# EAGLE design mazel293d (EAGLE 9.6.2)
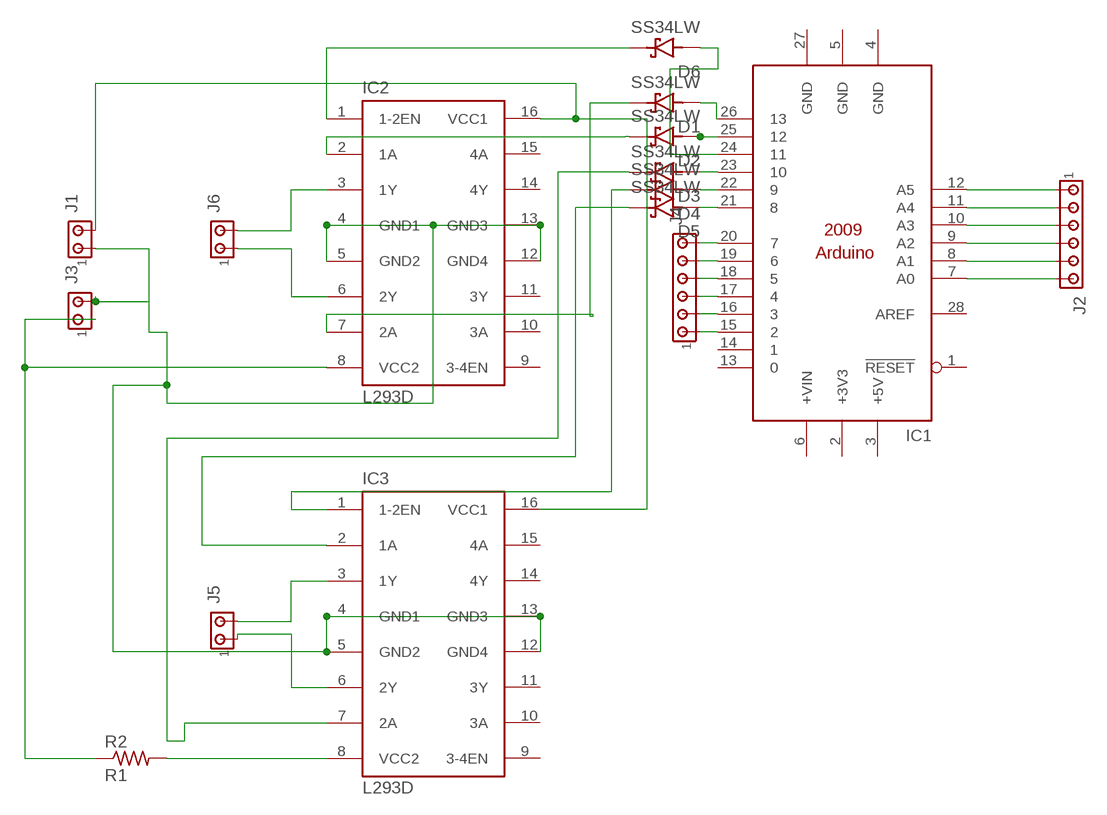
[diagram p0: schematic, sheet 1]

## Parts
D1  SS34LW  [SODFL3718X102N]
D2  SS34LW  [SODFL3718X102N]
D3  SS34LW  [SODFL3718X102N]
D4  SS34LW  [SODFL3718X102N]
D5  SS34LW  [SODFL3718X102N]
D6  SS34LW  [SODFL3718X102N]
IC1  ARDUINO2009_10  [ARDUINO2009]
IC2  L293D  [DIL16]
IC3  L293D  [DIL16]
J1  MTA02-100  [10X02MTA]
J2  Line Tracer Relimate  MTA06-100  [10X06MTA]
J3  MTA02-100  [10X02MTA]
J4  Line Tracer Relimate  MTA06-100  [10X06MTA]
J5  MTA02-100  [10X02MTA]
J6  MTA02-100  [10X02MTA]
R2  R1  R-US_0204/7  [0204/7]

## Nets
N$1: IC3.8(VCC2) R2.2
N$2: IC1.12(A5) J2.6
N$3: IC3.3(1Y) J5.2
N$4: IC3.6(2Y) J5.1
N$5: D1.A IC1.26
N$6: IC2.3(1Y) J6.2
N$7: IC1.20 J4.1
N$8: IC1.19 J4.2
N$9: IC2.6(2Y) J6.1
N$10: D6.C(K) IC2.1(1-2EN)
N$11: IC1.18 J4.3
N$12: IC2.4(GND1) IC2.5(GND2) IC2.12(GND4) IC2.13(GND3) IC3.4(GND1) IC3.5(GND2) IC3.12(GND4) IC3.13(GND3) J1.1 J3.2
N$13: D2.C(K) IC2.2(1A)
N$14: D2.A IC1.25
N$15: IC1.17 J4.4
N$16: IC1.16 J4.5
N$17: IC1.15 J4.6
N$18: IC1.11(A4) J2.5
N$19: IC1.10(A3) J2.4
N$20: IC1.9(A2) J2.3
N$21: IC1.8(A1) J2.2
N$22: IC1.7(A0) J2.1
N$23: D1.C(K) IC2.7(2A)
N$24: D3.C(K) IC3.7(2A)
N$25: D5.C(K) IC3.2(1A)
N$26: D4.C(K) IC3.1(1-2EN)
N$27: D3.A IC1.23
N$28: D4.A IC1.22
N$29: D5.A IC1.21
N$30: IC2.16(VCC1) IC3.16(VCC1) J1.2
N$31: D6.A IC1.24
N$32: IC2.8(VCC2) J3.1 R2.1
Unconnected: IC1.1(!RESET) IC1.6(+VIN) IC1.13 IC1.14 IC1.28(AREF) IC2.9(3-4EN) IC2.10(3A) IC2.11(3Y) IC2.14(4Y) IC2.15(4A) IC3.9(3-4EN) IC3.10(3A) IC3.11(3Y) IC3.14(4Y) IC3.15(4A)

## Power pins joined to a net without a drawn wire
+3V3: IC1.2(+3V3)
+5V: IC1.3(+5V)
GND: IC1.4(GND) IC1.5(GND) IC1.27(GND)

## Library data of the parts
D1-D6 = SS34LW:SS34LW: Check availability <https://pricing.snapeda.com/parts/SS34LW/Taiwan%20Semiconductor/view-part?ref=eda>; AVAILABILITY: In Stock; CHECK_PRICES: https://www.snapeda.com/parts/SS34LW/Taiwan+Semiconductor/view-part/?ref=eda; DESCRIPTION: 3A, 40V, Schottky Rectifier; MF: Taiwan Semiconductor; MP: SS34LW; PACKAGE: SOD-123W-2 Taiwan Semiconductor; PRICE: None; PURCHASE-URL: https://www.snapeda.com/api/url_track_click_mouser/?unipart_id=4812745&manufacturer=Taiwan Semiconductor&part_name=SS34LW&search_term=ss34; SNAPEDA_LINK: https://www.snapeda.com/parts/SS34LW/Taiwan+Semiconductor/view-part/?ref=snap
IC1 = arduino:ARDUINO2009_1: The Arduino Duemilanove ("2009") is a microcontroller board based on the ATmega168 or ATmega328. - 14 digital input/output pins (of which 6 can be used as PWM outputs) - 6 analog inputs, a 16 MHz crystal oscillator - USB connection - power jack - ISP header - reset button It contains everything needed to support the microcontroller; simply connect it to a computer with a USB cable or power it with a AC-to-DC adapter or battery to get started http://arduino.cc/en/Main/ArduinoBoardDuemilanove
IC2 IC3 = st-microelectronics:L293D: PUSH-PULL 4 CHANNEL DRIVER; MPN: L293D; OC_FARNELL: 9589619; OC_NEWARK: 56P8249
J1 J3 J5 J6 = con-amp:MTA02-100: AMP connector
J2 J4 = con-amp:MTA06-100: AMP connector
R2 = adafruit:R-US_: RESISTOR, American symbol

## Board
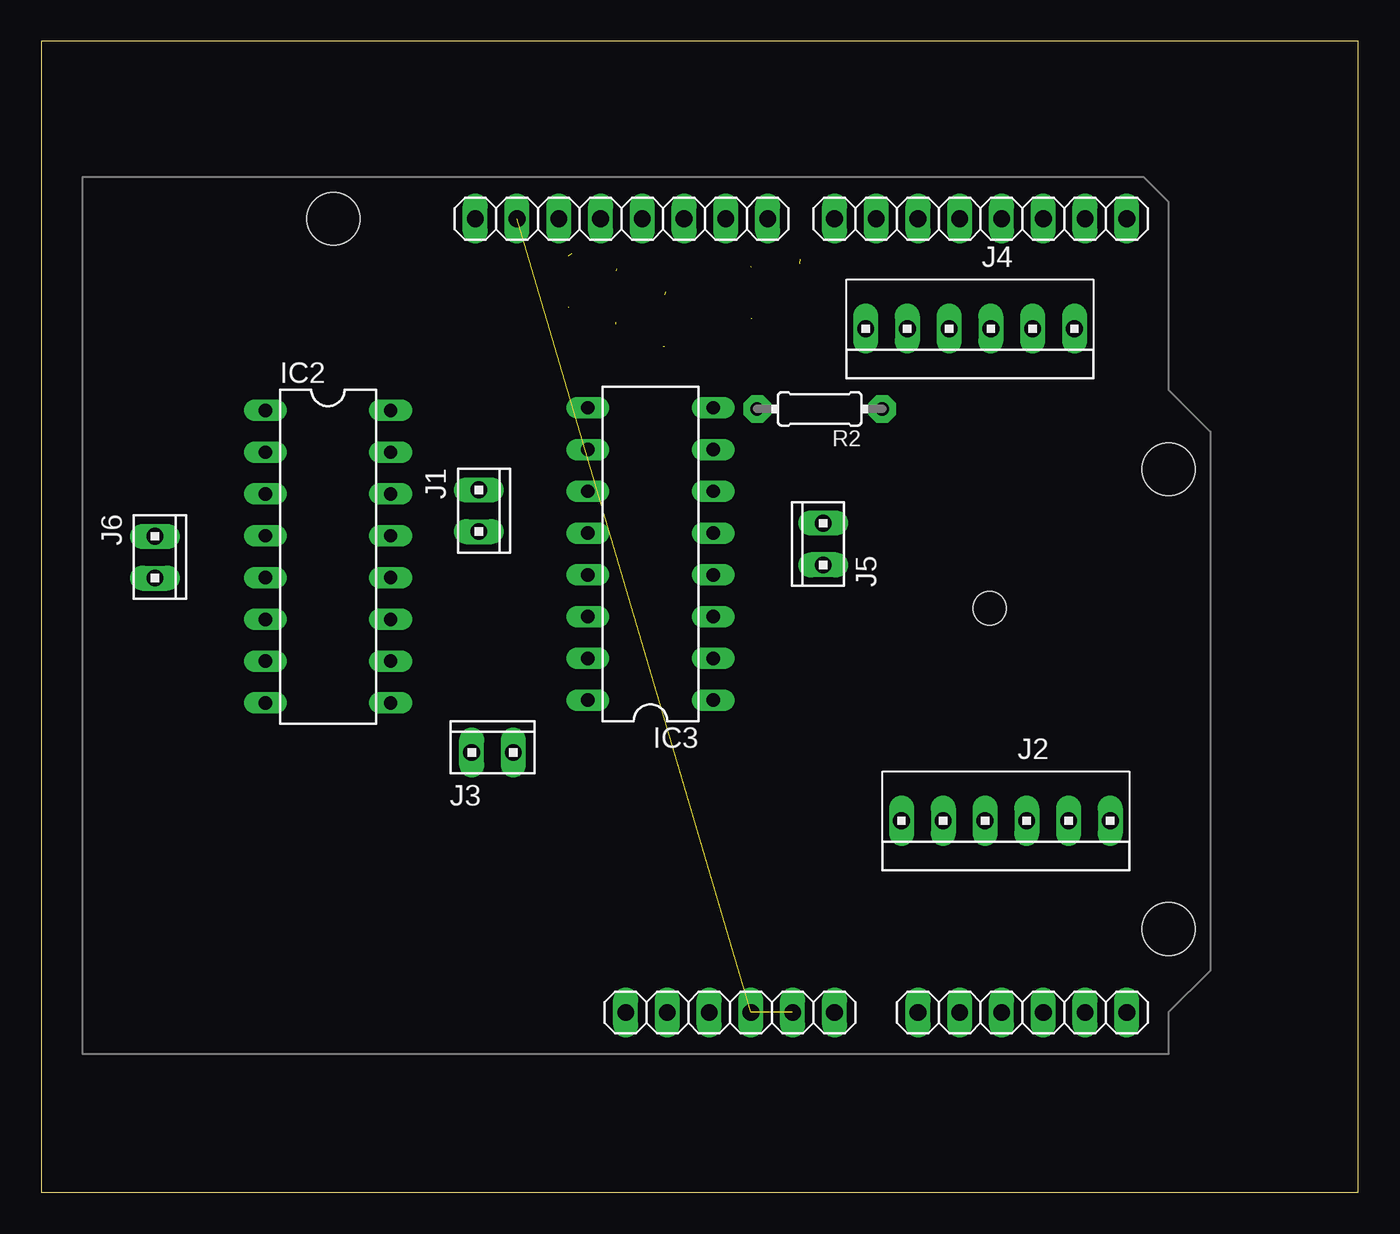
[diagram p1: board, top side]
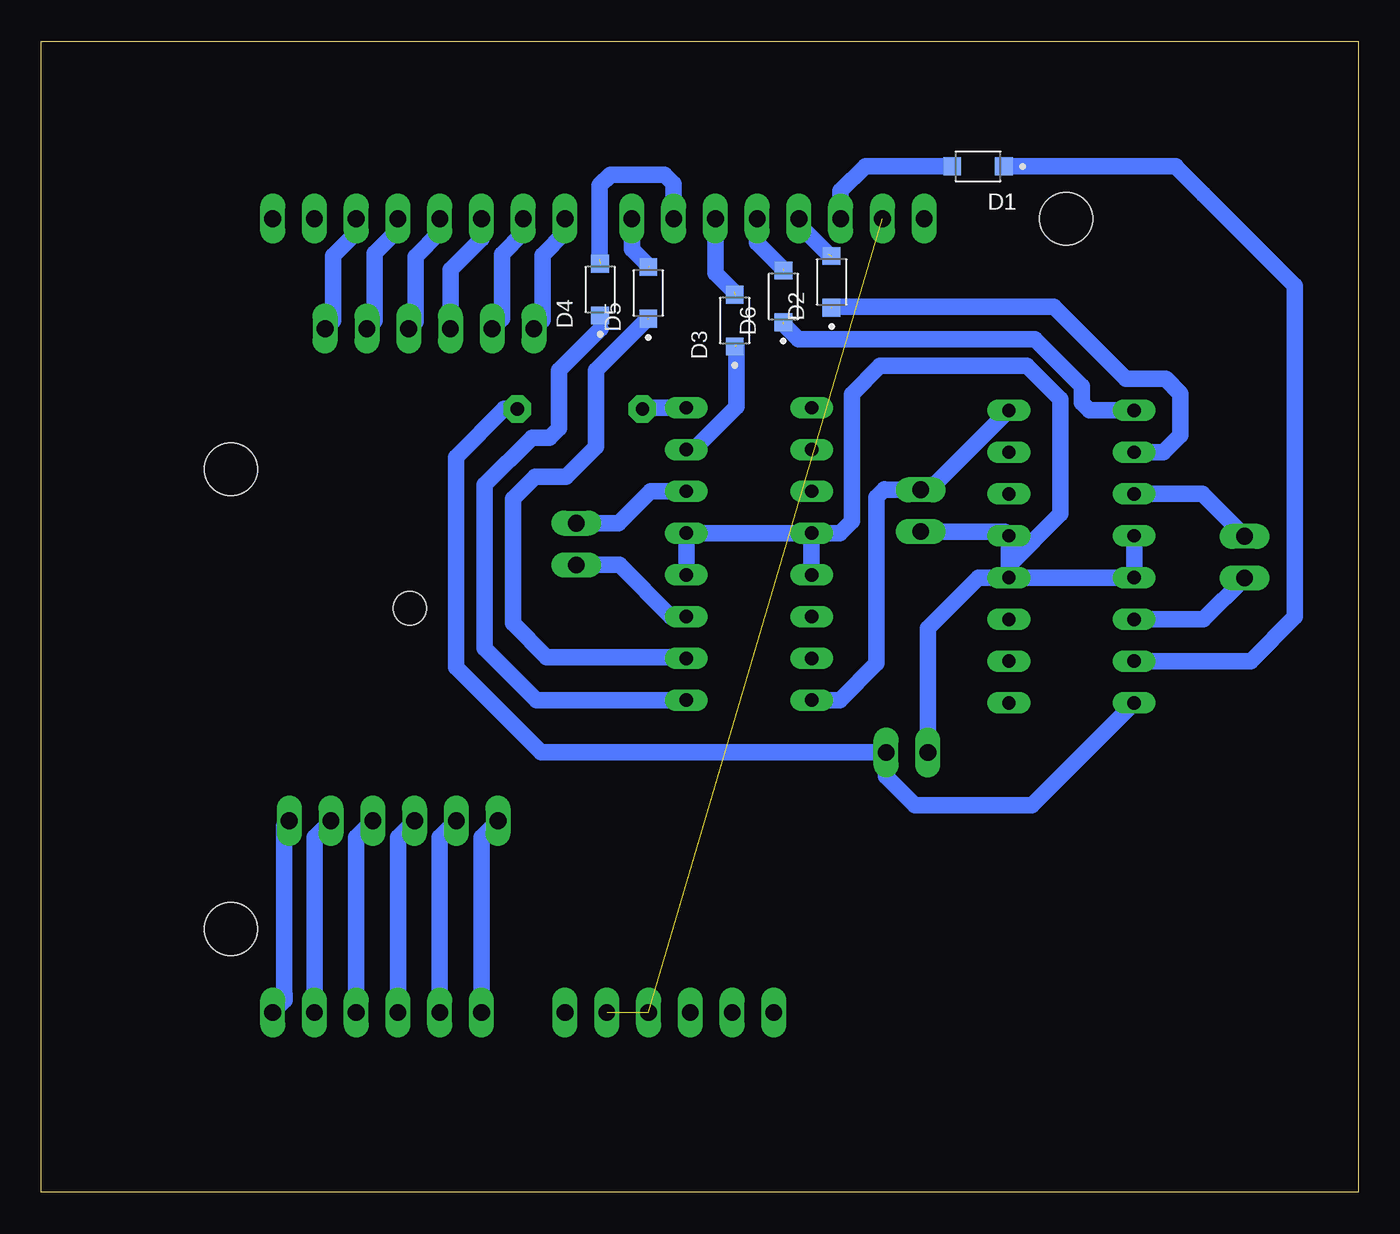
[diagram p2: board, bottom side, seen from below]

Size 80.12 x 70 mm. Coordinates in mm from the lower left corner, seen from the top.
Outline: 0,0 80.12,0 80.12,70 0,70 0,0
Copper layers (1*16): Top 0.035mm / dielectric 1.5mm / Bottom 0.035mm
Design rules "default": minimum track width 6mil, minimum drill 0.35mm, track to track 6mil, track to pad 6mil, pad to pad 6mil, via to via 6mil, smd to smd 6mil, copper to edge 40mil, drill to drill 6mil, minimum pad ring 10mil, minimum via ring 8mil, stop-mask expansion 4mil, vias tented up to drill 0mil, thermal gap 10mil

### Footprints (pad centres in the part's own frame; a part is rotated, then mirrored left to right if it is on the bottom)
SODFL3718X102N = smd 1.08 x 1.09: A 1.575,0; C -1.575,0
ARDUINO2009 = drill 1.016 long: 1 33.02,2.54; 2 35.56,2.54; 3 38.1,2.54; 4 40.64,2.54; 5 43.18,2.54; 6 45.72,2.54; 7 50.8,2.54; 8 53.34,2.54; 9 55.88,2.54; 10 58.42,2.54; 11 60.96,2.54; 12 63.5,2.54; 13 63.5,50.8; 14 60.96,50.8; 15 58.42,50.8; 16 55.88,50.8; 17 53.34,50.8; 18 50.8,50.8; 19 48.26,50.8; 20 45.72,50.8; 21 41.656,50.8; 22 39.116,50.8; 23 36.576,50.8; 24 34.036,50.8; 25 31.496,50.8; 26 28.956,50.8; 27 26.416,50.8; 28 23.876,50.8 | hole 3.2: 15.24,50.8; 66.04,35.56; 66.04,7.62 | hole 2: 55.17,27.114
DIL16 = drill 0.813 long: 1 -8.89,-3.81; 2 -6.35,-3.81; 3 -3.81,-3.81; 4 -1.27,-3.81; 5 1.27,-3.81; 6 3.81,-3.81; 7 6.35,-3.81; 8 8.89,-3.81; 9 8.89,3.81; 10 6.35,3.81; 11 3.81,3.81; 12 1.27,3.81; 13 -1.27,3.81; 14 -3.81,3.81; 15 -6.35,3.81; 16 -8.89,3.81
10X02MTA = drill 1.016 long: 1 1.27,0; 2 -1.27,0
10X06MTA = drill 1.016 long: 1 6.35,0; 2 3.81,0; 3 1.27,0; 4 -1.27,0; 5 -3.81,0; 6 -6.35,0
0204/7 = drill 0.813 pad 1.676 octagon: 1 -3.81,0; 2 3.81,0

### Placement (x,y rotation side)
D1  23.13,62.38 180 bottom
D2  32.04,55.36 90 bottom
D3  37.93,53.01 90 bottom
D4  46.12,54.9 90 bottom
D5  43.19,54.69 90 bottom
D6  34.97,54.48 90 bottom
IC1  2.53,8.41 0 top
IC2  17.45,38.66 270 top
IC3  37.06,38.82 90 top
J1  26.62,41.45 270 top
J2  58.67,22.6 180 top
J3  27.46,26.75 0 top
J4  56.49,52.52 180 top
J5  47.57,39.42 90 top
J6  6.91,38.63 270 top
R2  47.35,47.64 180 top

### Tracks (layer width: path | path; a pad name or v marks a point on that pad's centre or on a via)
GND  (2 unrouted)
N$1
  Bottom 1.016: IC3.8 43.47,47.71 R2.2
N$2
  Bottom 1.016: J2.6 65.32,22.31 65.32,12.03 65.3,12.05 65.3,11.68 IC1.12
N$3
  Bottom 1.016: IC3.3 41.81,35.01 44.95,38.15 J5.2
N$4
  Bottom 1.016: IC3.6 43.06,42.63 45,40.69 J5.1
N$5
  Bottom 1.016: IC1.26 31.49,60.89 29.99,62.38 D1.A
N$6
  Bottom 1.016: J6.2 9.48,42.47 IC2.3
N$7
  Bottom 1.016: IC1.20 48.25,58.37 49.63,56.99 49.63,53.03 J4.1
N$8
  Bottom 1.016: IC1.19 50.79,58.35 52.09,57.05 52.09,53.11 J4.2
N$9
  Bottom 1.016: J6.1 9.43,34.85 IC2.6
N$10  (1 unrouted)
  Bottom 1.016: IC2.1 16.35,47.55 16.81,48 16.81,49.02 19.67,51.88 34.06,51.88 34.97,52.79
N$11
  Bottom 1.016: IC1.18 53.33,58 55.22,56.1 J4.3
N$12
  Bottom 1.016: 21.26,38.11 IC2.13 21.51,40.18 J1.1 | 21.26,38.11 IC2.12 | IC2.12 IC2.5 IC2.4 | IC3.13 IC3.12 | IC3.12 IC3.5 IC3.4 | IC3.12 31.52,40.09 30.81,40.8 30.81,48.54 29.09,50.26 20.15,50.26 18.11,48.22 18.11,41.26 21.26,38.11 | IC2.12 23.1,37.39 26.19,34.3 J3.2
N$13  (1 unrouted)
  Bottom 1.016: IC2.2 11.86,45.01 10.83,46.03 10.83,48.58 11.72,49.47 14.14,49.47 18.52,53.85 32.04,53.85 32.08,53.81
N$14  (1 unrouted)
  Bottom 1.016: IC1.25 34.03,58.85 32.25,57.07
N$15
  Bottom 1.016: IC1.17 55.87,58.37 57.34,56.9 57.34,52.94 J4.4
N$16
  Bottom 1.016: IC1.16 58.41,58.52 59.82,57.11 59.82,53 J4.5
N$17
  Bottom 1.016: IC1.15 60.95,58.34 62.35,56.94 62.35,53.01 J4.6
N$18
  Bottom 1.016: IC1.11 63.49,21.59 J2.5
N$19
  Bottom 1.016: IC1.10 60.95,21.59 J2.4
N$20
  Bottom 1.016: IC1.9 58.41,21.59 J2.3
N$21
  Bottom 1.016: IC1.8 55.87,21.59 J2.2
N$22
  Bottom 1.016: IC1.7 53.33,21.59 J2.1
N$23
  Bottom 1.016: IC2.7 6.55,32.31 3.86,35 3.86,55.14 9.42,60.7 11.09,62.37 11.11,62.38 D1.C
N$24  (1 unrouted)
  Bottom 1.016: IC3.7 40.45,45.17 37.84,47.78 37.84,51.45
N$25  (1 unrouted)
  Bottom 1.016: IC3.2 40.95,32.55 49.36,32.55 51.42,34.61 51.42,42.17 50.09,43.51 48.19,43.51 46.37,45.33 46.37,50 43.24,53.13 43.23,53.13
N$26
  Bottom 0.152: D4.C 46.12,52.54 46.1,52.52
  Bottom 1.016: IC3.1 49.97,29.93 53.14,33.09 53.14,43.02 50.27,45.88 49.2,45.88 48.61,46.47 48.61,50 46.1,52.52
N$27  (1 unrouted)
  Bottom 1.016: IC1.23 39.11,55.89 37.99,54.77
N$28  (1 unrouted)
  Bottom 1.016: IC1.22 41.65,61.34 42.2,61.89 45.49,61.89 46.15,61.23 46.15,56.73
N$29  (1 unrouted)
  Bottom 1.016: IC1.21 44.19,57.35 43.15,56.32
N$30
  Bottom 1.016: IC2.16 26.09,42.72 J1.2 28.79,42.72 28.82,42.75 29.31,42.26 29.31,32.16 31.54,29.93 IC3.16
N$31  (1 unrouted)
  Bottom 1.016: IC1.24 36.57,57.73 34.99,56.15
N$32
  Bottom 1.016: IC2.8 19.85,23.55 26.96,23.55 28.73,25.32 J3.1 49.7,26.75 54.87,31.92 54.87,44.72 51.94,47.64 R2.1